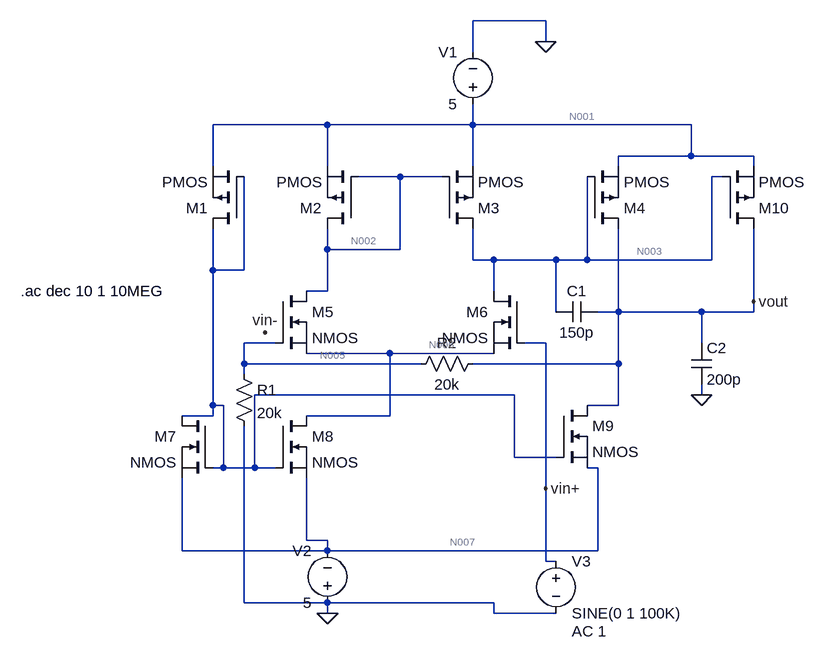
[diagram p0: schematic basicmillerV11.asc]
basicmillerV11.asc, the LTspice schematic file:
Version 4.1
SHEET 1 880 764
WIRE 480 -192 368 -192
WIRE 480 -160 480 -192
WIRE 368 -144 368 -192
WIRE 144 -32 -32 -32
WIRE 368 -32 368 -64
WIRE 368 -32 144 -32
WIRE 704 -32 368 -32
WIRE 704 16 704 -32
WIRE 704 16 592 16
WIRE 800 16 704 16
WIRE -32 32 -32 -32
WIRE 144 32 144 -32
WIRE 368 32 368 -32
WIRE 592 32 592 16
WIRE 800 32 800 16
WIRE 256 48 192 48
WIRE 320 48 256 48
WIRE 752 48 736 48
WIRE 144 160 144 128
WIRE 256 160 256 48
WIRE 256 160 144 160
WIRE 368 176 368 128
WIRE 400 176 368 176
WIRE 496 176 400 176
WIRE 544 176 544 48
WIRE 544 176 496 176
WIRE 736 176 736 48
WIRE 736 176 544 176
WIRE -32 192 -32 128
WIRE 16 192 16 48
WIRE 16 192 -32 192
WIRE 144 224 144 160
WIRE 144 224 112 224
WIRE 400 224 400 176
WIRE 800 240 800 128
WIRE 496 256 496 176
WIRE 592 256 592 128
WIRE 592 256 560 256
WIRE 720 256 592 256
WIRE 800 256 800 240
WIRE 800 256 720 256
WIRE 64 304 16 304
WIRE 480 304 448 304
WIRE 720 304 720 256
WIRE 240 320 112 320
WIRE 400 320 240 320
WIRE 16 336 16 304
WIRE 288 336 16 336
WIRE 592 336 592 256
WIRE 592 336 368 336
WIRE 16 352 16 336
WIRE 432 384 32 384
WIRE 720 384 720 368
WIRE -32 400 -32 192
WIRE -16 400 -32 400
WIRE 592 400 592 336
WIRE 592 400 544 400
WIRE -32 416 -32 400
WIRE -32 416 -80 416
WIRE 240 416 240 320
WIRE 240 416 112 416
WIRE 432 480 432 384
WIRE 496 480 432 480
WIRE -16 496 -16 400
WIRE -16 496 -32 496
WIRE 32 496 32 384
WIRE 32 496 -16 496
WIRE 64 496 32 496
WIRE 560 496 544 496
WIRE 480 528 480 304
WIRE 112 608 112 512
WIRE 144 608 112 608
WIRE -80 624 -80 512
WIRE 144 624 144 608
WIRE 144 624 -80 624
WIRE 560 624 560 496
WIRE 560 624 144 624
WIRE 480 640 480 528
WIRE 496 640 480 640
WIRE 16 704 16 432
WIRE 144 704 16 704
WIRE 400 704 144 704
WIRE 144 720 144 704
WIRE 400 720 400 704
WIRE 496 720 400 720
FLAG 480 -160 0
FLAG 144 720 0
FLAG 720 384 0
FLAG 800 240 vout
FLAG 480 528 vin+
FLAG 48 288 vin-
SYMBOL pmos 16 128 R180
SYMATTR InstName M1
SYMBOL pmos 192 128 R180
SYMATTR InstName M2
SYMBOL pmos 320 128 M180
SYMATTR InstName M3
SYMBOL pmos 544 128 M180
SYMATTR InstName M4
SYMBOL nmos 64 224 R0
SYMATTR InstName M5
SYMBOL nmos 448 224 M0
SYMATTR InstName M6
SYMBOL nmos -32 416 M0
SYMATTR InstName M7
SYMBOL nmos 64 416 R0
SYMATTR InstName M8
SYMBOL nmos 496 400 R0
SYMATTR InstName M9
SYMBOL pmos 752 128 M180
SYMATTR InstName M10
SYMBOL voltage 368 -48 R180
WINDOW 0 24 96 Left 2
WINDOW 3 24 16 Left 2
SYMATTR InstName V1
SYMATTR Value 5
SYMBOL res 0 336 R0
SYMATTR InstName R1
SYMATTR Value 20k
SYMBOL voltage 144 720 R180
WINDOW 0 24 96 Left 2
WINDOW 3 24 16 Left 2
SYMATTR InstName V2
SYMATTR Value 5
SYMBOL voltage 496 624 R0
WINDOW 123 24 124 Left 2
WINDOW 39 0 0 Left 0
SYMATTR Value2 AC 1
SYMATTR InstName V3
SYMATTR Value SINE(0 1 100K)
SYMBOL res 384 320 R90
WINDOW 0 0 56 VBottom 2
WINDOW 3 32 56 VTop 2
SYMATTR InstName R2
SYMATTR Value 20k
SYMBOL cap 560 240 R90
WINDOW 0 0 32 VBottom 2
WINDOW 3 32 32 VTop 2
SYMATTR InstName C1
SYMATTR Value 150p
SYMBOL cap 704 304 R0
SYMATTR InstName C2
SYMATTR Value 200p
TEXT -328 224 Left 2 !.ac dec 10 1 10MEG

The netlist it stands for:
* basicmillerV11.asc
M1 N004 N004 N001 N001 PMOS
M2 N002 N002 N001 N001 PMOS
M3 N003 N002 N001 N001 PMOS
M4 vout N003 N001 N001 PMOS
M5 N002 N005 N006 N006 NMOS
M6 N003 vin+ N006 N006 NMOS
M7 N004 N004 N007 N007 NMOS
M8 N006 N004 N007 N007 NMOS
M9 vout N004 N007 N007 NMOS
M10 vout N003 N001 N001 PMOS
V1 N001 0 5
R1 N005 0 20k
V2 0 N007 5
V3 vin+ 0 SINE(0 1 100K) AC 1
R2 vout N005 20k
C1 vout N003 150p
C2 vout 0 200p
.model NMOS NMOS
.model PMOS PMOS
.lib standard.mos
.ac dec 10 1 10MEG
.backanno
.end

* Results of the author's LTspice run, read from the files saved beside the schematic
* Operating Point, zero values left out:
*   V(n001) = 5 V
*   V(n002) = 2.113 V
*   V(n003) = 1.464 V
*   V(n005) = -44.95 nV
*   V(n006) = -2.887 V
*   V(n007) = -5 V
*   V(vout) = -89.9 nV
*   I(R1) = -2.247 pA
*   I(R2) = -2.247 pA
*   I(V1) = -666.7 µA
*   I(V2) = -666.7 µA
*   Ib(M1) = 5.01 pA
*   Ib(M10) = 5.01 pA
*   Ib(M2) = 2.897 pA
*   Ib(M3) = 3.546 pA
*   Ib(M4) = 5.01 pA
*   Ib(M5) = -5.01 pA
*   Ib(M6) = -4.361 pA
*   Ib(M7) = -5.01 pA
*   Ib(M8) = -2.123 pA
*   Ib(M9) = -5.01 pA
*   Id(M1) = -250 µA
*   Id(M10) = -125 µA
*   Id(M2) = -83.33 µA
*   Id(M3) = -83.33 µA
*   Id(M4) = -125 µA
*   Id(M5) = 83.33 µA
*   Id(M6) = 83.33 µA
*   Id(M7) = 250 µA
*   Id(M8) = 166.7 µA
*   Id(M9) = 250 µA
*   Is(M1) = 250 µA
*   Is(M10) = 125 µA
*   Is(M2) = 83.33 µA
*   Is(M3) = 83.33 µA
*   Is(M4) = 125 µA
*   Is(M5) = -83.33 µA
*   Is(M6) = -83.33 µA
*   Is(M7) = -250 µA
*   Is(M8) = -166.7 µA
*   Is(M9) = -250 µA
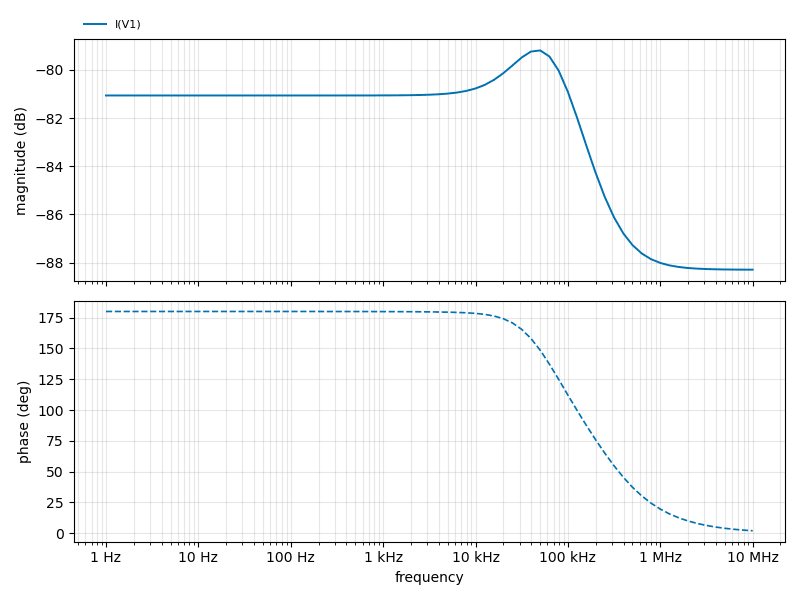
[diagram p1: AC Analysis of basicmillerV11.asc, plotted from the saved traces]
* AC Analysis, 1 run:
*   I(V1): -81.06 dB at 1 Hz, -88.29 dB at 10 MHz, peak -79.19 dB at 50.12 kHz, 3 dB below the peak at 131.3 kHz